# EAGLE schematic MakerBot_MightyBoard_REVE (EAGLE 5.11)
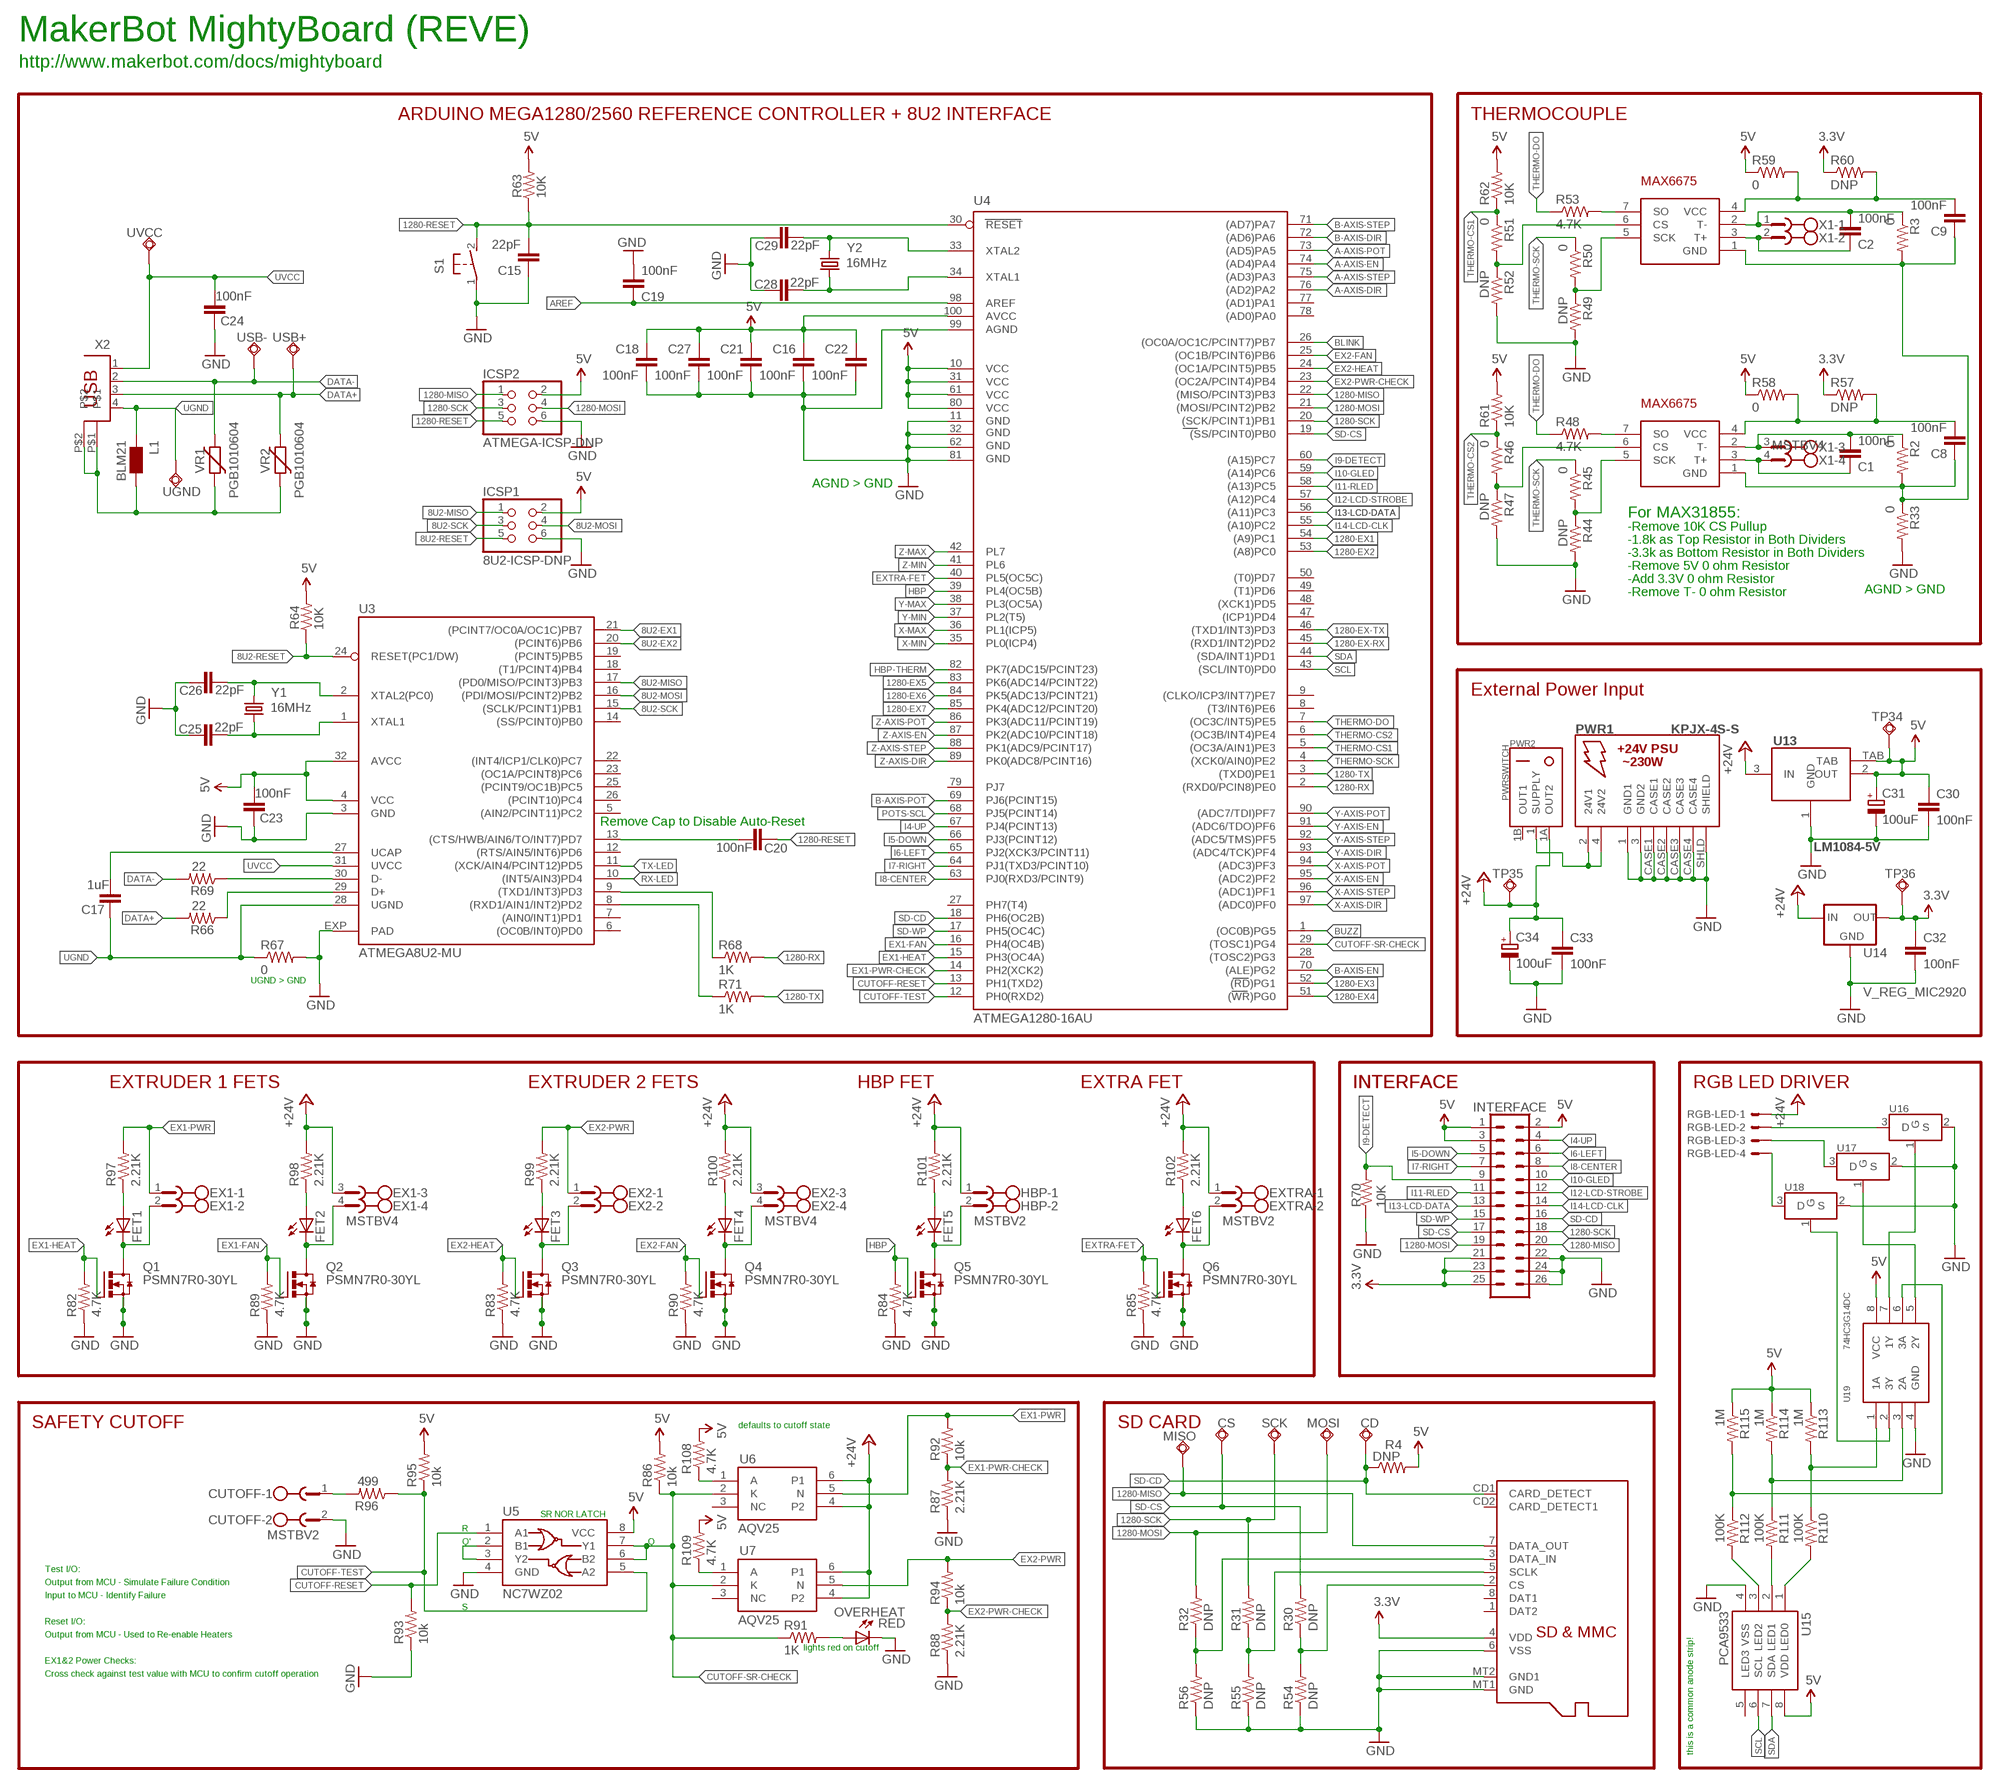
[diagram p0: schematic, sheet 1, part 1 of 2]
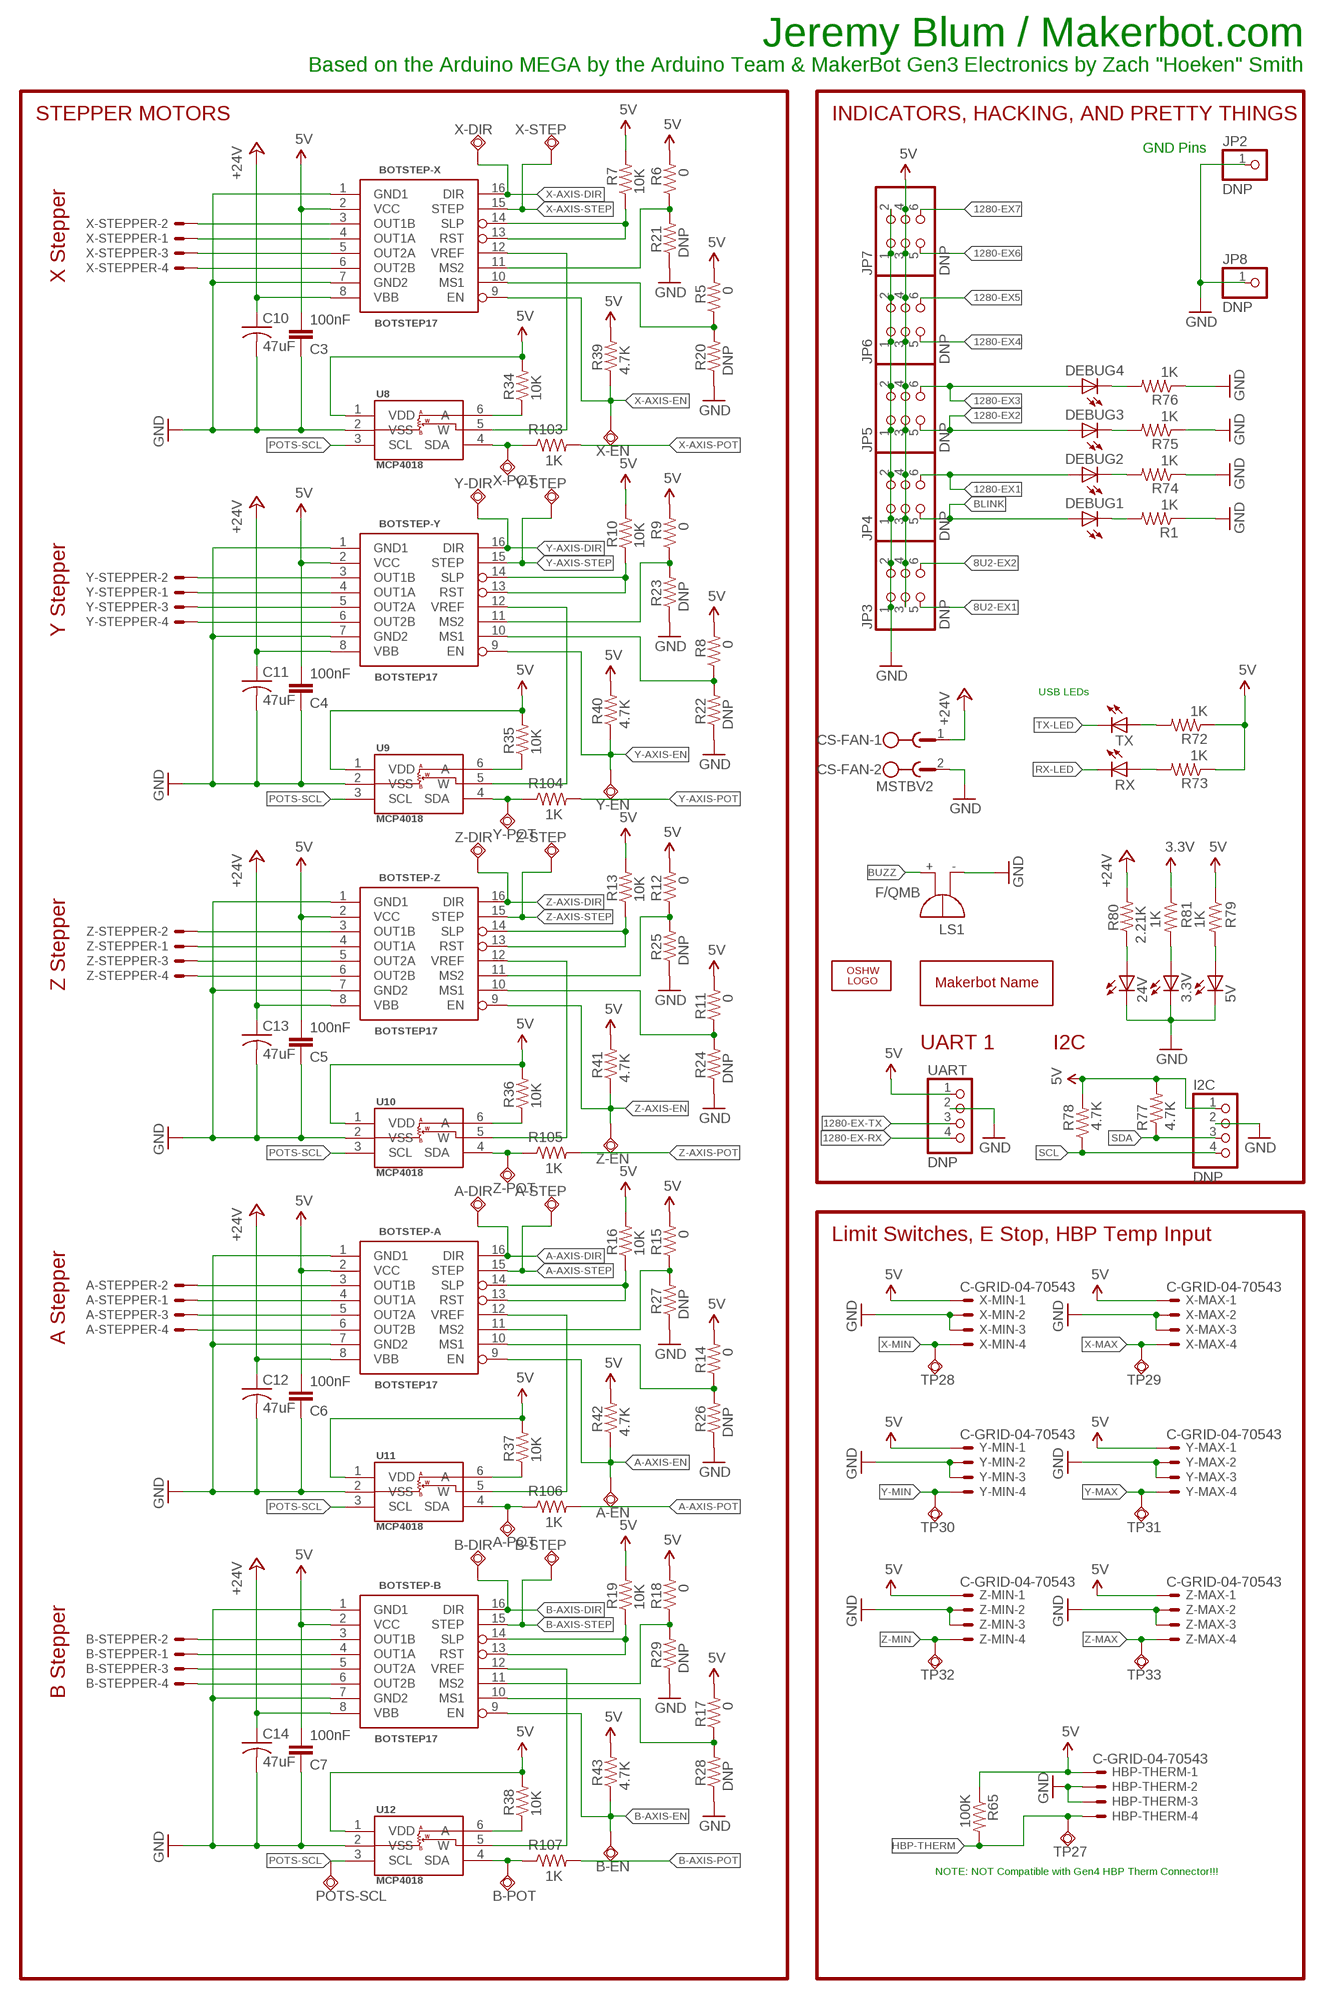
[diagram p1: schematic, sheet 1, part 2 of 2]

## Parts
3.3V  GREEN  LED0805  [LED-0805]
5V  GREEN  LED0805  [LED-0805]
24V  GREEN  LED0805  [LED-0805]
A-DIR  TPSQTP09R  [TP09R]
A-EN  TPSQTP09R  [TP09R]
A-POT  TPSQTP09R  [TP09R]
A-STEP  TPSQTP09R  [TP09R]
A-STEPPER  KK-156-4  [KK-156-4]
B-DIR  TPSQTP09R  [TP09R]
B-EN  TPSQTP09R  [TP09R]
B-POT  TPSQTP09R  [TP09R]
B-STEP  TPSQTP09R  [TP09R]
B-STEPPER  KK-156-4  [KK-156-4]
BOTSTEP-A  BOTSTEP17  BOTSTEP17CHIP-DOWN  [BOTSTEP17-INV]
BOTSTEP-B  BOTSTEP17  BOTSTEP17CHIP-DOWN  [BOTSTEP17-INV]
BOTSTEP-X  BOTSTEP17  BOTSTEP17CHIP-DOWN  [BOTSTEP17-INV]
BOTSTEP-Y  BOTSTEP17  BOTSTEP17CHIP-DOWN  [BOTSTEP17-INV]
BOTSTEP-Z  BOTSTEP17  BOTSTEP17CHIP-DOWN  [BOTSTEP17-INV]
C1  100nF  CAP0805  [0805]
C2  100nF  CAP0805  [0805]
C3  100nF  CAP0805  [0805]
C4  100nF  CAP0805  [0805]
C5  100nF  CAP0805  [0805]
C6  100nF  CAP0805  [0805]
C7  100nF  CAP0805  [0805]
C8  100nF  CAP0805  [0805]
C9  100nF  CAP0805  [0805]
C10  47uF  C-US  [CAP2917]
C11  47uF  C-US  [CAP2917]
C12  47uF  C-US  [CAP2917]
C13  47uF  C-US  [CAP2917]
C14  47uF  C-US  [CAP2917]
C15  22pF  CAP0805  [0805]
C16  100nF  CAP0805  [0805]
C17  1uF  CAP0805  [0805]
C18  100nF  CAP0805  [0805]
C19  100nF  CAP0805  [0805]
C20  100nF  CAP0805  [0805]
C21  100nF  CAP0805  [0805]
C22  100nF  CAP0805  [0805]
C23  100nF  CAP0805  [0805]
C24  100nF  CAP0805  [0805]
C25  22pF  CAP0805  [0805]
C26  22pF  CAP0805  [0805]
C27  100nF  CAP0805  [0805]
C28  22pF  CAP0805  [0805]
C29  22pF  CAP0805  [0805]
C30  100nF  CAP0805  [0805]
C31  100uF  CPOL-EUE3.5-8  [E3,5-8]
C32  100nF  CAP0805  [0805]
C33  100nF  CAP0805  [0805]
C34  100uF  CPOL-EUE3.5-8  [E3,5-8]
CD  TPSQTP09R  [TP09R]
CS  TPSQTP09R  [TP09R]
CS-FAN  MSTBV2  [MSTBV2]
CUTOFF  MSTBV2  [MSTBV2]
DEBUG1  GREEN  LED0805  [LED-0805]
DEBUG2  GREEN  LED0805  [LED-0805]
DEBUG3  GREEN  LED0805  [LED-0805]
DEBUG4  GREEN  LED0805  [LED-0805]
EX1  MSTBV4  [MSTBV4]
EX2  MSTBV4  [MSTBV4]
EXTRA  MSTBV2  [MSTBV2]
FET1  GREEN  LED0805  [LED-0805]
FET2  GREEN  LED0805  [LED-0805]
FET3  GREEN  LED0805  [LED-0805]
FET4  GREEN  LED0805  [LED-0805]
FET5  GREEN  LED0805  [LED-0805]
FET6  GREEN  LED0805  [LED-0805]
HBP  MSTBV2  [MSTBV2]
HBP-THERM  C-GRID-04-70543  [70543-04]
I2C  DNP  PINHD-1X4  [1X04]
ICSP1  8U2-ICSP-DNP  PINHD-2X3  [2X03]
ICSP2  ATMEGA-ICSP-DNP  PINHD-2X3  [2X03]
INTERFACE  ML26  [ML26]
JP2  DNP  PINHD-1X1  [1X01]
JP3  DNP  PINHD-2X3  [2X03]
JP4  DNP  PINHD-2X3  [2X03]
JP5  DNP  PINHD-2X3  [2X03]
JP6  DNP  PINHD-2X3  [2X03]
JP7  DNP  PINHD-2X3  [2X03]
JP8  DNP  PINHD-1X1  [1X01]
L1  BLM21  WE-CBF_0805  [0805]
LOGO1  MAKERBOTNAME  [MAKERBOTNAME1]
LOGO2  OSHW_LOGO_10MILX0200-NT  [OSHW_10X200_NOTEXT]
LS1  F/QMB  [F/QMB]
MISO  TPSQTP09R  [TP09R]
MOSI  TPSQTP09R  [TP09R]
MP1  DNP  MICROSD  [MICROSD]
OVERHEAT  RED  LED0805  [LED-0805]
POTS-SCL  TPSQTP09R  [TP09R]
PWR1  KPJX-4S-S  [JPJX-4S-S]
PWR2  PWRSWITCH  [D501JT2S2APQF]
Q1  PSMN7R0-30YL  [SOT669]
Q2  PSMN7R0-30YL  [SOT669]
Q3  PSMN7R0-30YL  [SOT669]
Q4  PSMN7R0-30YL  [SOT669]
Q5  PSMN7R0-30YL  [SOT669]
Q6  PSMN7R0-30YL  [SOT669]
R1  1K  RESISTOR  [0805]
R2  0  RESISTOR  [0805]
R3  0  RESISTOR  [0805]
R4  DNP  RESISTOR  [0805]
R5  0  RESISTOR  [0805]
R6  0  RESISTOR  [0805]
R7  10K  RESISTOR  [0805]
R8  0  RESISTOR  [0805]
R9  0  RESISTOR  [0805]
R10  10K  RESISTOR  [0805]
R11  0  RESISTOR  [0805]
R12  0  RESISTOR  [0805]
R13  10K  RESISTOR  [0805]
R14  0  RESISTOR  [0805]
R15  0  RESISTOR  [0805]
R16  10K  RESISTOR  [0805]
R17  0  RESISTOR  [0805]
R18  0  RESISTOR  [0805]
R19  10K  RESISTOR  [0805]
R20  DNP  RESISTOR  [0805]
R21  DNP  RESISTOR  [0805]
R22  DNP  RESISTOR  [0805]
R23  DNP  RESISTOR  [0805]
R24  DNP  RESISTOR  [0805]
R25  DNP  RESISTOR  [0805]
R26  DNP  RESISTOR  [0805]
R27  DNP  RESISTOR  [0805]
R28  DNP  RESISTOR  [0805]
R29  DNP  RESISTOR  [0805]
R30  DNP  RESISTOR  [0805]
R31  DNP  RESISTOR  [0805]
R32  DNP  RESISTOR  [0805]
R33  0  RESISTOR  [0805]
R34  10K  RESISTOR  [0805]
R35  10K  RESISTOR  [0805]
R36  10K  RESISTOR  [0805]
R37  10K  RESISTOR  [0805]
R38  10K  RESISTOR  [0805]
R39  4.7K  RESISTOR  [0805]
R40  4.7K  RESISTOR  [0805]
R41  4.7K  RESISTOR  [0805]
R42  4.7K  RESISTOR  [0805]
R43  4.7K  RESISTOR  [0805]
R44  DNP  RESISTOR  [0805]
R45  0  RESISTOR  [0805]
R46  0  RESISTOR  [0805]
R47  DNP  RESISTOR  [0805]
R48  4.7K  RESISTOR  [0805]
R49  DNP  RESISTOR  [0805]
R50  0  RESISTOR  [0805]
R51  0  RESISTOR  [0805]
R52  DNP  RESISTOR  [0805]
R53  4.7K  RESISTOR  [0805]
R54  DNP  RESISTOR  [0805]
R55  DNP  RESISTOR  [0805]
R56  DNP  RESISTOR  [0805]
R57  DNP  RESISTOR  [0805]
R58  0  RESISTOR  [0805]
R59  0  RESISTOR  [0805]
R60  DNP  RESISTOR  [0805]
R61  10K  RESISTOR  [0805]
R62  10K  RESISTOR  [0805]
R63  10K  RESISTOR  [0805]
R64  10K  RESISTOR  [0805]
R65  100K  RESISTOR  [0805]
R66  22  RESISTOR  [0805]
R67  0  RESISTOR  [0805]
R68  1K  RESISTOR  [0805]
R69  22  RESISTOR  [0805]
R70  10K  RESISTOR  [0805]
R71  1K  RESISTOR  [0805]
R72  1K  RESISTOR  [0805]
R73  1K  RESISTOR  [0805]
R74  1K  RESISTOR  [0805]
R75  1K  RESISTOR  [0805]
R76  1K  RESISTOR  [0805]
R77  4.7K  RESISTOR  [0805]
R78  4.7K  RESISTOR  [0805]
R79  1K  RESISTOR  [0805]
R80  2.21K  RESISTOR  [0805]
R81  1K  RESISTOR  [0805]
R82  4.7K  RESISTOR  [0805]
R83  4.7K  RESISTOR  [0805]
R84  4.7K  RESISTOR  [0805]
R85  4.7K  RESISTOR  [0805]
R86  10k  RESISTOR  [0805]
R87  2.21K  RESISTOR  [0805]
R88  2.21K  RESISTOR  [0805]
R89  4.7K  RESISTOR  [0805]
R90  4.7K  RESISTOR  [0805]
R91  1K  RESISTOR  [0805]
R92  10k  RESISTOR  [0805]
R93  10k  RESISTOR  [0805]
R94  10k  RESISTOR  [0805]
R95  10k  RESISTOR  [0805]
R96  499  RESISTOR  [0805]
R97  2.21K  RESISTOR  [0805]
R98  2.21K  RESISTOR  [0805]
R99  2.21K  RESISTOR  [0805]
R100  2.21K  RESISTOR  [0805]
R101  2.21K  RESISTOR  [0805]
R102  2.21K  RESISTOR  [0805]
R103  1K  RESISTOR  [0805]
R104  1K  RESISTOR  [0805]
R105  1K  RESISTOR  [0805]
R106  1K  RESISTOR  [0805]
R107  1K  RESISTOR  [0805]
R108  4.7K  RESISTOR  [0805]
R109  4.7K  RESISTOR  [0805]
R110  100K  RESISTOR  [0805]
R111  100K  RESISTOR  [0805]
R112  100K  RESISTOR  [0805]
R113  1M  RESISTOR  [0805]
R114  1M  RESISTOR  [0805]
R115  1M  RESISTOR  [0805]
RGB-LED  C-GRID-04-70543  [70543-04]
RX  GREEN  LED0805  [LED-0805]
S1  31-XX  [B3F-31XX]
SCK  TPSQTP09R  [TP09R]
TP27  TPSQTP09R  [TP09R]
TP28  TPSQTP09R  [TP09R]
TP29  TPSQTP09R  [TP09R]
TP30  TPSQTP09R  [TP09R]
TP31  TPSQTP09R  [TP09R]
TP32  TPSQTP09R  [TP09R]
TP33  TPSQTP09R  [TP09R]
TP34  TPSQTP09R  [TP09R]
TP35  TPSQTP09R  [TP09R]
TP36  TPSQTP09R  [TP09R]
TX  GREEN  LED0805  [LED-0805]
U1  MAX6675  [SO08]
U2  MAX6675  [SO08]
U3  ATMEGA8U2-MU  [QFN32]
U4  ATMEGA1280-16AU  [TQFP100]
U5  NC7WZ02  [US8]
U6  AQV25  AQV25EXISTS  [AQV25-DIPSM]
U7  AQV25  AQV25EXISTS  [AQV25-DIPSM]
U8  MCP4018  [SC70-6L]
U9  MCP4018  [SC70-6L]
U10  MCP4018  [SC70-6L]
U11  MCP4018  [SC70-6L]
U12  MCP4018  [SC70-6L]
U13  LM1084-5V  [TO-263]
U14  V_REG_MIC2920  [SOT223]
U15  PCA9533  [SO8]
U16  FDV301N  [SOT-23]
U17  FDV301N  [SOT-23]
U18  FDV301N  [SOT-23]
U19  74HC3G14DC  [VSSOP8]
UART  DNP  PINHD-1X4  [1X04]
UGND  TPSQTP09R  [TP09R]
USB+  TPSQTP09R  [TP09R]
USB-  TPSQTP09R  [TP09R]
UVCC  TPSQTP09R  [TP09R]
VR1  PGB1010604  VARISTORCN0603  [CT/CN0603]
VR2  PGB1010604  VARISTORCN0603  [CT/CN0603]
X1  MSTBV4  [MSTBV4]
X2  USBA  [SMARTPRJ_PN61729]
X-DIR  TPSQTP09R  [TP09R]
X-EN  TPSQTP09R  [TP09R]
X-MAX  C-GRID-04-70543  [70543-04]
X-MIN  C-GRID-04-70543  [70543-04]
X-POT  TPSQTP09R  [TP09R]
X-STEP  TPSQTP09R  [TP09R]
X-STEPPER  KK-156-4  [KK-156-4]
Y1  16MHz  CRYTALHC49S  [HC49/S]
Y2  16MHz  CRYTALHC49S  [HC49/S]
Y-DIR  TPSQTP09R  [TP09R]
Y-EN  TPSQTP09R  [TP09R]
Y-MAX  C-GRID-04-70543  [70543-04]
Y-MIN  C-GRID-04-70543  [70543-04]
Y-POT  TPSQTP09R  [TP09R]
Y-STEP  TPSQTP09R  [TP09R]
Y-STEPPER  KK-156-4  [KK-156-4]
Z-DIR  TPSQTP09R  [TP09R]
Z-EN  TPSQTP09R  [TP09R]
Z-MAX  C-GRID-04-70543  [70543-04]
Z-MIN  C-GRID-04-70543  [70543-04]
Z-POT  TPSQTP09R  [TP09R]
Z-STEP  TPSQTP09R  [TP09R]
Z-STEPPER  KK-156-4  [KK-156-4]

## Nets
3.3V [3.3V]: C32.1 INTERFACE.21 INTERFACE.23 INTERFACE.25 MP1.4(VDD) R57.1 R60.1 R81.1 TP36.TP U14.3(OUT)
5V [5V]: BOTSTEP-A.2(VCC) BOTSTEP-B.2(VCC) BOTSTEP-X.2(VCC) BOTSTEP-Y.2(VCC) BOTSTEP-Z.2(VCC) C3.2 C4.2 C5.2 C6.2 C7.2 C16.1 C18.1 C21.1 C22.1 C23.2 C27.1 C30.1 C31.+ HBP-THERM.1 I2C.1 ICSP1.2 ICSP2.2 INTERFACE.1 INTERFACE.2 INTERFACE.3 JP3.3 JP3.4 JP4.3 JP4.4 JP5.3 JP5.4 JP6.3 JP6.4 JP7.3 JP7.4 R4.2 R5.2 R6.2 R7.2 R8.2 R9.2 R10.2 R11.2 R12.2 R13.2 R14.2 R15.2 R16.2 R17.2 R18.2 R19.2 R34.2 R35.2 R36.2 R37.2 R38.2 R39.2 R40.2 R41.2 R42.2 R43.2 R58.1 R59.1 R61.2 R62.2 R63.2 R64.2 R65.1 R72.1 R73.1 R77.2 R78.2 R79.1 R86.2 R95.2 R108.2 R109.2 R113.1 R114.1 R115.1 TP34.TP U3.4(VCC) U3.32(AVCC) U4.10(VCC) U4.31(VCC1) U4.61(VCC2) U4.80(VCC3) U4.100(AVCC) U5.8(VCC) U8.1(VDD) U9.1(VDD) U10.1(VDD) U11.1(VDD) U12.1(VDD) U13.2(OUT) U13.TAB U15.8(VDD) U19.8(VCC) UART.1 X-MAX.1 X-MIN.1 Y-MAX.1 Y-MIN.1 Z-MAX.1 Z-MIN.1
8U2-EX1: JP3.5 U3.21((PCINT7/OC0A/OC1C)PB7)
8U2-EX2: JP3.6 U3.20((PCINT6)PB6)
8U2-MISO: ICSP1.1 U3.17((PD0/MISO/PCINT3)PB3)
8U2-MOSI: ICSP1.4 U3.16((PDI/MOSI/PCINT2)PB2)
8U2-RESET: ICSP1.5 R64.1 U3.24(RESET(PC1/DW))
8U2-SCK: ICSP1.3 U3.15((SCLK/PCINT1)PB1)
1280-EX1: DEBUG2.A JP4.6 U4.54((A9)PC1)
1280-EX2: DEBUG3.A JP5.5 U4.53((A8)PC0)
1280-EX3: DEBUG4.A JP5.6 U4.52((RD)PG1)
1280-EX4: JP6.5 U4.51((WR)PG0)
1280-EX5: JP6.6 U4.83(PK6(ADC14/PCINT22))
1280-EX6: JP7.5 U4.84(PK5(ADC13/PCINT21))
1280-EX7: JP7.6 U4.85(PK4(ADC12/PCINT20))
1280-EX-RX: U4.45((RXD1/INT2)PD2) UART.4
1280-EX-TX: U4.46((TXD1/INT3)PD3) UART.3
1280-MISO: ICSP2.1 INTERFACE.20 MISO.TP MP1.7(DATA_OUT) U4.22((MISO/PCINT3)PB3)
1280-MOSI: ICSP2.4 INTERFACE.19 MOSI.TP R32.2 U4.21((MOSI/PCINT2)PB2)
1280-RESET: C15.2 C20.1 ICSP2.5 R63.1 S1.2(S) U4.30(RESET)
1280-RX: R68.2 U4.2((RXD0/PCIN8)PE0)
1280-SCK: ICSP2.3 INTERFACE.18 R31.2 SCK.TP U4.20((SCK/PCINT1)PB1)
1280-TX: R71.2 U4.3((TXD0)PE1)
+24V [24V]: BOTSTEP-A.8(VBB) BOTSTEP-B.8(VBB) BOTSTEP-X.8(VBB) BOTSTEP-Y.8(VBB) BOTSTEP-Z.8(VBB) C10.1 C11.1 C12.1 C13.1 C14.1 C33.1 C34.+ CS-FAN.1 EX1.3 EX2.3 EXTRA.1 HBP.1 PWR2.1A(OUT2) R80.2 R98.2 R100.2 R101.2 R102.2 RGB-LED.1 TP35.TP U6.4(P2) U6.6(P1) U7.4(P2) U7.6(P1) U13.3(IN) U14.1(IN)
A-AXIS-DIR: A-DIR.TP BOTSTEP-A.16(DIR) U4.76((AD2)PA2)
A-AXIS-EN: A-EN.TP BOTSTEP-A.9(EN) R42.1 U4.74((AD4)PA4)
A-AXIS-POT: R106.2 U4.73((AD5)PA5)
A-AXIS-STEP: A-STEP.TP BOTSTEP-A.15(STEP) U4.75((AD3)PA3)
APWR1 [24V]: EX1.4 FET2.C Q2.MB(D)
AREF: C19.1 U4.98(AREF)
B-AXIS-DIR: B-DIR.TP BOTSTEP-B.16(DIR) U4.72((AD6)PA6)
B-AXIS-EN: B-EN.TP BOTSTEP-B.9(EN) R43.1 U4.70((ALE)PG2)
B-AXIS-POT: R107.2 U4.69(PJ6(PCINT15))
B-AXIS-STEP: B-STEP.TP BOTSTEP-B.15(STEP) U4.71((AD7)PA7)
BLINK: DEBUG1.A JP4.5 U4.26((OC0A/OC1C/PCINT7)PB7)
BPWR [24V]: EX2.2 FET3.C Q3.MB(D)
BPWR1 [24V]: EX2.4 FET4.C Q4.MB(D)
BUZZ: LS1.+(-) U4.1((OC0B)PG5)
CPWR [24V]: FET5.C HBP.2 Q5.MB(D)
CUTOFF-RESET: R93.2 U4.13(PH1(TXD2)) U5.1(A1)
CUTOFF-SR-CHECK: R86.1 R91.1 U4.29((TOSC1)PG4) U5.6(B2) U5.7(Y1) U6.2(K) U7.2(K)
CUTOFF-TEST: R95.1 R96.1 U4.12(PH0(RXD2)) U5.5(A2)
DATA+: R66.2 USB+.TP VR2.2 X2.3
DATA-: R69.2 USB-.TP VR1.2 X2.2
DPWR [24V]: EXTRA.2 FET6.C Q6.MB(D)
DTR: C20.2 U3.13((CTS/HWB/AIN6/TO/INT7)PD7)
EX1-FAN: Q2.4(G) R89.2 U4.16(PH4(OC4B))
EX1-HEAT: Q1.4(G) R82.2 U4.15(PH3(OC4A))
EX1-PWR [24V]: EX1.1 R92.2 R97.2 U6.5(N)
EX1-PWR-CHECK: R87.2 R92.1 U4.14(PH2(XCK2))
EX2-FAN: Q4.4(G) R90.2 U4.25((OC1B/PCINT6)PB6)
EX2-HEAT: Q3.4(G) R83.2 U4.24((OC1A/PCINT5)PB5)
EX2-PWR [24V]: EX2.1 R94.2 R99.2 U7.5(N)
EX2-PWR-CHECK: R88.2 R94.1 U4.23((OC2A/PCINT4)PB4)
EXTRA-FET: Q6.4(G) R85.2 U4.40(PL5(OC5C))
GND [gnd]: 3.3V.C 5V.C 24V.C BOTSTEP-A.1(GND1) BOTSTEP-A.7(GND2) BOTSTEP-B.1(GND1) BOTSTEP-B.7(GND2) BOTSTEP-X.1(GND1) BOTSTEP-X.7(GND2) BOTSTEP-Y.1(GND1) BOTSTEP-Y.7(GND2) BOTSTEP-Z.1(GND1) BOTSTEP-Z.7(GND2) C3.1 C4.1 C5.1 C6.1 C7.1 C10.2 C11.2 C12.2 C13.2 C14.2 C15.1 C16.2 C18.2 C19.2 C21.2 C22.2 C23.1 C24.1 C25.1 C26.1 C27.2 C28.1 C29.1 C30.2 C31.- C32.2 C33.2 C34.- CS-FAN.2 CUTOFF.2 HBP-THERM.2 HBP-THERM.3 I2C.2 ICSP1.6 ICSP2.6 INTERFACE.22 INTERFACE.24 INTERFACE.26 JP2.1 JP3.1 JP3.2 JP4.1 JP4.2 JP5.1 JP5.2 JP6.1 JP6.2 JP7.1 JP7.2 JP8.1 LS1.-(+) MP1.6(VSS) MP1.MT1(GND) MP1.MT2(GND1) OVERHEAT.C PWR1.1(GND1) PWR1.3(GND2) PWR1.CASE1 PWR1.CASE2 PWR1.CASE3 PWR1.CASE4 PWR1.SHLD(SHIELD) Q1.1(S) Q1.2(S) Q1.3(S) Q2.1(S) Q2.2(S) Q2.3(S) Q3.1(S) Q3.2(S) Q3.3(S) Q4.1(S) Q4.2(S) Q4.3(S) Q5.1(S) Q5.2(S) Q5.3(S) Q6.1(S) Q6.2(S) Q6.3(S) R1.1 R20.1 R21.1 R22.1 R23.1 R24.1 R25.1 R26.1 R27.1 R28.1 R29.1 R33.2 R44.2 R47.2 R49.2 R52.2 R54.1 R55.1 R56.1 R67.2 R70.1 R74.1 R75.1 R76.1 R82.1 R83.1 R84.1 R85.1 R87.1 R88.1 R89.1 R90.1 R93.1 S1.1(P) U3.3(GND) U3.EXP(PAD) U4.11(GND) U4.32(GND1) U4.62(GND2) U4.81(GND3) U4.99(AGND) U5.4(GND) U8.2(VSS) U9.2(VSS) U10.2(VSS) U11.2(VSS) U12.2(VSS) U13.1(GND) U14.2(GND) U15.4(VSS) U16.2(S) U17.2(S) U18.2(S) U19.4(GND) UART.2 X-MAX.2 X-MAX.3 X-MIN.2 X-MIN.3 Y-MAX.2 Y-MAX.3 Y-MIN.2 Y-MIN.3 Z-MAX.2 Z-MAX.3 Z-MIN.2 Z-MIN.3
HBP: Q5.4(G) R84.2 U4.39(PL4(OC5B))
HBP-THERM: HBP-THERM.4 R65.2 TP27.TP U4.82(PK7(ADC15/PCINT23))
I4-UP: INTERFACE.4 U4.67(PJ4(PCINT13))
I5-DOWN: INTERFACE.5 U4.66(PJ3(PCINT12))
I6-LEFT: INTERFACE.6 U4.65(PJ2(XCK3/PCINT11))
I7-RIGHT: INTERFACE.7 U4.64(PJ1(TXD3/PCINT10))
I8-CENTER: INTERFACE.8 U4.63(PJ0(RXD3/PCINT9))
I9-DETECT: INTERFACE.9 R70.2 U4.60((A15)PC7)
I10-GLED: INTERFACE.10 U4.59((A14)PC6)
I11-RLED: INTERFACE.11 U4.58((A13)PC5)
I12-LCD-STROBE: INTERFACE.12 U4.57((A12)PC4)
I13-LCD-DATA: INTERFACE.13 U4.56((A11)PC3)
I14-LCD-CLK: INTERFACE.14 U4.55((A10)PC2)
M8RXD: R68.1 U3.9((TXD1/INT3)PD3)
M8TXD: R71.1 U3.8((RXD1/AIN1/INT2)PD2)
N$1: 3.3V.A R81.2
N$2: C28.2 U4.34(XTAL1) Y2.1
N$3: 5V.A R79.2
N$4: DEBUG4.C R76.2
N$5: R51.2 R52.1 U2.6(CS)
N$6: DEBUG1.C R1.2
N$7: C1.1 U1.3(T+) X1.4
N$8 [24V]: FET2.A R98.1
N$9 [24V]: FET4.A R100.1
N$10: 24V.A R80.1
N$11: R49.1 R50.2 U2.5(SCK)
N$12 [24V]: FET6.A R102.1
N$13: C29.2 U4.33(XTAL2) Y2.2
N$14: DEBUG2.C R74.2
N$15: DEBUG3.C R75.2
N$16: C2.2 R3.1 U2.2(T-) X1.1
N$17 [24V]: FET5.A R101.1
N$18: BOTSTEP-X.10(MS1) R5.1 R20.2
N$22: C1.2 R2.1 U1.2(T-) X1.3
N$27: C9.2 R59.2 R60.2 U2.4(VCC)
N$28: CUTOFF.1 R96.2
N$34: R53.2 U2.7(SO)
N$36: R48.2 U1.7(SO)
N$37: BOTSTEP-X.13(RST) BOTSTEP-X.14(SLP) R7.1
N$41 [24V]: FET1.A R97.1
N$42 [24V]: FET3.A R99.1
N$56: C2.1 U2.3(T+) X1.2
N$96: BOTSTEP-X.12(VREF) U8.5(W)
N$98: R34.1 U8.6(A)
N$100: BOTSTEP-X.11(MS2) R6.1 R21.2
N$102: BOTSTEP-Y.13(RST) BOTSTEP-Y.14(SLP) R10.1
N$104: BOTSTEP-X.3(OUT1B) X-STEPPER.2
N$105: BOTSTEP-X.4(OUT1A) X-STEPPER.1
N$106: BOTSTEP-X.5(OUT2A) X-STEPPER.3
N$107: BOTSTEP-X.6(OUT2B) X-STEPPER.4
N$108: OVERHEAT.A R91.2
N$109 [24V]: PWR1.2(24V1) PWR1.4(24V2) PWR2.1(SUPPLY)
N$111: BOTSTEP-Y.12(VREF) U9.5(W)
N$112: R35.1 U9.6(A)
N$114: BOTSTEP-Y.11(MS2) R9.1 R23.2
N$115: BOTSTEP-Y.3(OUT1B) Y-STEPPER.2
N$117: BOTSTEP-Y.4(OUT1A) Y-STEPPER.1
N$118: BOTSTEP-Y.5(OUT2A) Y-STEPPER.3
N$120: BOTSTEP-Y.6(OUT2B) Y-STEPPER.4
N$121: BOTSTEP-Y.10(MS1) R8.1 R22.2
N$122: BOTSTEP-Z.13(RST) BOTSTEP-Z.14(SLP) R13.1
N$124: BOTSTEP-Z.12(VREF) U10.5(W)
N$126: R36.1 U10.6(A)
N$161: BOTSTEP-Z.11(MS2) R12.1 R25.2
N$162: BOTSTEP-Z.3(OUT1B) Z-STEPPER.2
N$163: BOTSTEP-Z.4(OUT1A) Z-STEPPER.1
N$164: BOTSTEP-Z.5(OUT2A) Z-STEPPER.3
N$165: BOTSTEP-Z.6(OUT2B) Z-STEPPER.4
N$166: BOTSTEP-Z.10(MS1) R11.1 R24.2
N$172: BOTSTEP-A.13(RST) BOTSTEP-A.14(SLP) R16.1
N$173: BOTSTEP-A.12(VREF) U11.5(W)
N$176: R37.1 U11.6(A)
N$177: BOTSTEP-A.11(MS2) R15.1 R27.2
N$179: A-STEPPER.2 BOTSTEP-A.3(OUT1B)
N$182: A-STEPPER.1 BOTSTEP-A.4(OUT1A)
N$183: A-STEPPER.3 BOTSTEP-A.5(OUT2A)
N$185: A-STEPPER.4 BOTSTEP-A.6(OUT2B)
N$188: BOTSTEP-A.10(MS1) R14.1 R26.2
N$189: BOTSTEP-B.13(RST) BOTSTEP-B.14(SLP) R19.1
N$192: BOTSTEP-B.12(VREF) U12.5(W)
N$193: R38.1 U12.6(A)
N$194: BOTSTEP-B.11(MS2) R18.1 R29.2
N$195: B-STEPPER.2 BOTSTEP-B.3(OUT1B)
N$196: B-STEPPER.1 BOTSTEP-B.4(OUT1A)
N$198: B-STEPPER.3 BOTSTEP-B.5(OUT2A)
N$199: B-STEPPER.4 BOTSTEP-B.6(OUT2B)
N$200: BOTSTEP-B.10(MS1) R17.1 R28.2
N$201: R112.2 U15.3(LED2)
N$204: R111.2 U15.2(LED1)
N$205: R110.2 U15.1(LED0)
N$207: U5.2(B1) U5.3(Y2)
N$219: MP1.2(CS) R30.1 R54.2
N$220: R46.2 R47.1 U1.6(CS)
N$221: R44.1 R45.2 U1.5(SCK)
N$222 [5V]: C8.2 R57.2 R58.2 U1.4(VCC)
N$223: MP1.3(DATA_IN) R32.1 R56.2
N$224: MP1.5(SCLK) R31.1 R55.2
N$225: R73.2 RX.A
N$226: R72.2 TX.A
N$229: C8.1 C9.1 R2.2 R3.2 R33.1 U1.1(GND) U2.1(GND)
N$230: C25.2 U3.1(XTAL1) Y1.1
N$231: C26.2 U3.2(XTAL2(PC0)) Y1.2
N$305: R110.1 R113.2 U19.1(1A)
N$356: R103.1 U8.4(SDA) X-POT.TP
N$357: R104.1 U9.4(SDA) Y-POT.TP
N$359: R105.1 U10.4(SDA) Z-POT.TP
N$361: A-POT.TP R106.1 U11.4(SDA)
N$363: B-POT.TP R107.1 U12.4(SDA)
N$369 [5V]: R109.1 U7.1(A)
N$370 [5V]: R108.1 U6.1(A)
N$375: U17.1(G) U19.5(2Y)
N$376: U16.1(G) U19.7(1Y)
N$381: R112.1 R115.2 U19.6(3A)
N$388: RGB-LED.4 U18.3(D)
N$393: RGB-LED.3 U17.3(D)
N$394: RGB-LED.2 U16.3(D)
N$400: R111.1 R114.2 U19.3(2A)
N$403: U18.1(G) U19.2(3Y)
N$600 [24V]: EX1.2 FET1.C Q1.MB(D)
POTS-SCL: POTS-SCL.TP U4.68(PJ5(PCINT14)) U8.3(SCL) U9.3(SCL) U10.3(SCL) U11.3(SCL) U12.3(SCL)
RD+: R66.1 U3.29(D+)
RD-: R69.1 U3.30(D-)
RX-LED: RX.C U3.10((INT5/AIN3)PD4)
SCL: I2C.4 R78.1 U4.43((SCL/INT0)PD0) U15.6(SCL)
SD-CD: CD.TP INTERFACE.16 MP1.CD1(CARD_DETECT) R4.1 U4.18(PH6(OC2B))
SD-CS: CS.TP INTERFACE.17 R30.2 U4.19((SS/PCINT0)PB0)
SD-WP: INTERFACE.15 U4.17(PH5(OC4C))
SDA: I2C.3 R77.1 U4.44((SDA/INT1)PD1) U15.7(SDA)
THERMO-CS1: R51.1 R62.1 U4.5((OC3A/AIN1)PE3)
THERMO-CS2: R46.1 R61.1 U4.6((OC3B/INT4)PE4)
THERMO-DO: R48.1 R53.1 U4.7((OC3C/INT5)PE5)
THERMO-SCK: R45.1 R50.1 U4.4((XCK0/AIN0)PE2)
TX-LED: TX.C U3.11((XCK/AIN4/PCINT12)PD5)
UGND: C17.1 L1.1 R67.1 U3.28(UGND) UGND.TP X2.4
USHIELD: L1.2 VR1.1 VR2.1 X2.P$1 X2.P$2
UVCC: C24.2 U3.31(UVCC) UVCC.TP X2.1
VUCAP: C17.2 U3.27(UCAP)
X-AXIS-DIR: BOTSTEP-X.16(DIR) U4.97((ADC0)PF0) X-DIR.TP
X-AXIS-EN: BOTSTEP-X.9(EN) R39.1 U4.95((ADC2)PF2) X-EN.TP
X-AXIS-POT: R103.2 U4.94((ADC3)PF3)
X-AXIS-STEP: BOTSTEP-X.15(STEP) U4.96((ADC1)PF1) X-STEP.TP
X-MAX: TP29.TP U4.36(PL1(ICP5)) X-MAX.4
X-MIN: TP28.TP U4.35(PL0(ICP4)) X-MIN.4
Y-AXIS-DIR: BOTSTEP-Y.16(DIR) U4.93((ADC4/TCK)PF4) Y-DIR.TP
Y-AXIS-EN: BOTSTEP-Y.9(EN) R40.1 U4.91((ADC6/TDO)PF6) Y-EN.TP
Y-AXIS-POT: R104.2 U4.90((ADC7/TDI)PF7)
Y-AXIS-STEP: BOTSTEP-Y.15(STEP) U4.92((ADC5/TMS)PF5) Y-STEP.TP
Y-MAX: TP31.TP U4.38(PL3(OC5A)) Y-MAX.4
Y-MIN: TP30.TP U4.37(PL2(T5)) Y-MIN.4
Z-AXIS-DIR: BOTSTEP-Z.16(DIR) U4.89(PK0(ADC8/PCINT16)) Z-DIR.TP
Z-AXIS-EN: BOTSTEP-Z.9(EN) R41.1 U4.87(PK2(ADC10/PCINT18)) Z-EN.TP
Z-AXIS-POT: R105.2 U4.86(PK3(ADC11/PCINT19))
Z-AXIS-STEP: BOTSTEP-Z.15(STEP) U4.88(PK1(ADC9/PCINT17)) Z-STEP.TP
Z-MAX: TP33.TP U4.42(PL7) Z-MAX.4
Z-MIN: TP32.TP U4.41(PL6) Z-MIN.4
Unconnected: MP1.1(DAT2) MP1.8(DAT1) MP1.CD2(CARD_DETECT1) PWR2.1B(OUT1) U3.5((AIN2/PCINT11)PC2) U3.6((OC0B/INT0)PD0) U3.7((AIN0/INT1)PD1) U3.12((RTS/AIN5/INT6)PD6) U3.14((SS/PCINT0)PB0) U3.18((T1/PCINT4)PB4) U3.19((PCINT5)PB5) U3.22((INT4/ICP1/CLK0)PC7) U3.23((OC1A/PCINT8)PC6) U3.25((PCINT9/OC1B)PC5) U3.26((PCINT10)PC4) U4.8((T3/INT6)PE6) U4.9((CLKO/ICP3/INT7)PE7) U4.27(PH7(T4)) U4.28((TOSC2)PG3) U4.47((ICP1)PD4) U4.48((XCK1)PD5) U4.49((T1)PD6) U4.50((T0)PD7) U4.77((AD1)PA1) U4.78((AD0)PA0) U4.79(PJ7) U6.3(NC) U7.3(NC) U15.5(LED3)

## Notes on the sheet
- Jeremy Blum / Makerbot.com
- MakerBot MightyBoard (REVE)
- http://www.makerbot.com/docs/mightyboard | Based on the Arduino MEGA by the Arduino Team & MakerBot Gen3 Electronics by Zach "Hoeken" Smith
- ARDUINO MEGA1280/2560 REFERENCE CONTROLLER + 8U2 INTERFACE | THERMOCOUPLE | STEPPER MOTORS | INDICATORS, HACKING, AND PRETTY THINGS
- GND Pins
- X Stepper
- AGND > GND
- For MAX31855:
- -Remove 10K CS Pullup
- -1.8k as Top Resistor in Both Dividers
- -3.3k as Bottom Resistor in Both Dividers
- -Remove 5V 0 ohm Resistor
- Y Stepper
- -Add 3.3V 0 ohm Resistor
- -Remove T- 0 ohm Resistor | AGND > GND
- USB LEDs
- External Power Input
- Remove Cap to Disable Auto-Reset
- Z Stepper
- UART 1 | I2C
- UGND > GND
- EXTRUDER 1 FETS | EXTRUDER 2 FETS | HBP FET | EXTRA FET
- INTERFACE | INTERFACE | RGB LED DRIVER
- Limit Switches, E Stop, HBP Temp Input
- A Stepper
- SAFETY CUTOFF | defaults to cutoff state | SD CARD
- SR NOR LATCH
- B Stepper
- R
- Q' | Q
- Test I/O:
- Output from MCU - Simulate Failure Condition
- Input to MCU - Identify Failure
- S
- Reset I/O:
- Output from MCU - Used to Re-enable Heaters
- lights red on cutoff
- EX1&2 Power Checks:
- Cross check against test value with MCU to confirm cutoff operation | NOTE: NOT Compatible with Gen4 HBP Therm Connector!!!
- this is a common anode strip!

## Library data of the parts
3.3V 5V 24V DEBUG1-DEBUG4 FET1-FET6 OVERHEAT RX TX = SparkFun:LED: LEDs Standard schematic elements and footprints for 5mm, 3mm, 1206, and 0603 sized LEDs. 5mm - Spark Fun Electronics SKU : COM-00529 (and others)
A-DIR A-EN A-POT A-STEP B-DIR B-EN B-POT B-STEP CD CS MISO MOSI POTS-SCL SCK TP27-TP36 UGND USB+ USB- UVCC X-DIR X-EN X-POT X-STEP Y-DIR Y-EN Y-POT Y-STEP Z-DIR Z-EN Z-POT Z-STEP = testpad:TPSQ: Test pad
A-STEPPER B-STEPPER X-STEPPER Y-STEPPER Z-STEPPER = con-molex:KK-156-4: KK 156 HEADER Source: http://www.molex.com/pdm_docs/sd/026604100_sd.pdf; OC_FARNELL: unknown; OC_NEWARK: unknown
BOTSTEP-A BOTSTEP-B BOTSTEP-X BOTSTEP-Y BOTSTEP-Z = MakerBot:BOTSTEP17
C1-C9 C15-C30 C32 C33 = SparkFun:CAP: Capacitor Standard 0603 ceramic capacitor, and 0.1" leaded capacitor.
C10-C14 = adafruit:C-US: CAPACITOR, American symbol
C31 C34 = rcl:CPOL-EU: POLARIZED CAPACITOR, European symbol
CS-FAN CUTOFF EXTRA HBP = con-phoenix-508:MSTBV2: PHOENIX; MPN: MSTBV 2,5/2-GF-5.08; OC_FARNELL: 1792792; OC_NEWARK: 69R9845
EX1 EX2 X1 = con-phoenix-508:MSTBV4: PHOENIX; MPN: MSTBV 2,5/4-GF-5.08; OC_FARNELL: 1792794; OC_NEWARK: 69R9847
HBP-THERM RGB-LED X-MAX X-MIN Y-MAX Y-MIN Z-MAX Z-MIN = con-molex:C-GRID-04: CONNECTOR wire to board 2.54 mm (0.100") pitch header; OC_FARNELL: unknown; OC_NEWARK: unknown
I2C UART = pinhead:PINHD-1X4: PIN HEADER
ICSP1 ICSP2 JP3-JP7 = pinhead:PINHD-2X3: PIN HEADER
INTERFACE = con-harting-ml:ML26: HARTING; OC_FARNELL: unknown; OC_NEWARK: unknown
JP2 JP8 = pinhead:PINHD-1X1: PIN HEADER
L1 = wuerth-elektronik:WE-CBF: SMD EMI Suppression Ferrite Beads - excellent anti-EMI properties - low DCR - impedances till 3000 ohms - rated current up to 6 A
LOGO1 = MakerBot:MAKERBOTNAME
LOGO2 = OSHW:OSHW_LOGO_10MIL
LS1 = buzzer:F/QMB: BUZZER Source: Buerklin; OC_FARNELL: unknown; OC_NEWARK: unknown
MP1 = adafruit:MICROSD: Micro-SD / Transflash card holder with SPI pinout For the 3M # 2908-05WB-MG and/or 4UCON #19656 push-push type
PWR1 = MakerBot:KPJX-4S-S
PWR2 = MakerBot:PWRSWITCH
Q1-Q6 = MakerBot:PSMN7R0-30YL
R1-R115 = SparkFun:RESISTOR: Resistor Basic schematic elements and footprints for 0603, 1206, and PTH 1/10th watt (small) resistors.
S1 = switch-omron:31-XX: OMRON SWITCH
U1 U2 = reprap:MAX6675: Thermocouple amplifier and A to D converter
U3 = atmel:ATMEGA8U2-MU
U4 = atmel-2005:ATMEGA*: MICROCONTROLLER 64/128/256 Kbytes FLASH 4 Kbytes EEPROM 8 Kbytes SRAM 86 General Purpose I/O pins 12-channels16-bit PWM 4 x Serial USARTs 16-channels 10-bit A/D
U5 = MakerBot:NC7WZ02
U6 U7 = MakerBot:AQV25
U8-U12 = MakerBot:MCP4018
U13 = MakerBot:LM1084-5V
U14 = SparkFun:V_REG_MIC2920: MIC2920A (http://www.micrel.com/_PDF/mic2920.pdf) - 400mA output LDO Regulator
U15 = MakerBot:PCA9533
U16-U18 = MakerBot:FDV301N
U19 = MakerBot:74HC3G14DC
VR1 VR2 = varistor:VARISTOR: VARISTOR
X2 = reprap:USBA: BERG USB connector
Y1 Y2 = crystal:CRYTAL: CRYSTAL

## Net classes
0 default: width 0.203 mm, drill 0.508 mm, clearance 0.203 mm
1 24V: width 0.889 mm, drill 0.635 mm, clearance 0.508 mm
2 gnd: width 0.381 mm, drill 0.508 mm, clearance 0.254 mm
3 5V: width 0.381 mm, drill 0.508 mm, clearance 0.254 mm
4 3.3V: width 0.381 mm, drill 0.508 mm, clearance 0.254 mm
5 DC Motor: width 0.762 mm, drill 0.635 mm, clearance 0.254 mm